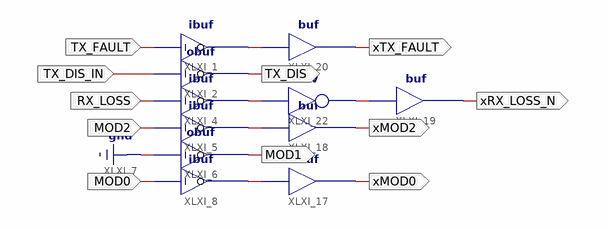
[diagram p0: schematic sheet 1]
// Xilinx ISE schematic fo_io.sch (spartan6) as structural Verilog: 11 symbols, 11 ports
module fo_io (
  input  TX_FAULT,
  input  TX_DIS_IN,
  input  RX_LOSS,
  input  MOD2,
  input  MOD0,
  output xTX_FAULT,
  output xMOD2,
  output xMOD0,
  output TX_DIS,
  output MOD1,
  output xRX_LOSS_N
);

  wire XLXN_32, XLXN_33, XLXN_34, XLXN_35, XLXN_38;

  ibuf XLXI_1 (.I(TX_FAULT), .O(XLXN_35));
  obuf XLXI_2 (.I(TX_DIS_IN), .O(TX_DIS));
  ibuf XLXI_4 (.I(RX_LOSS), .O(XLXN_38));
  ibuf XLXI_5 (.I(MOD2), .O(XLXN_33));
  obuf XLXI_6 (.I(1'b0), .O(MOD1));
  ibuf XLXI_8 (.I(MOD0), .O(XLXN_32));
  buf XLXI_17 (xMOD0, XLXN_32);
  buf XLXI_18 (xMOD2, XLXN_33);
  buf XLXI_20 (xTX_FAULT, XLXN_35);
  not XLXI_22 (XLXN_34, XLXN_38);
  buf XLXI_19 (xRX_LOSS_N, XLXN_34);
endmodule
